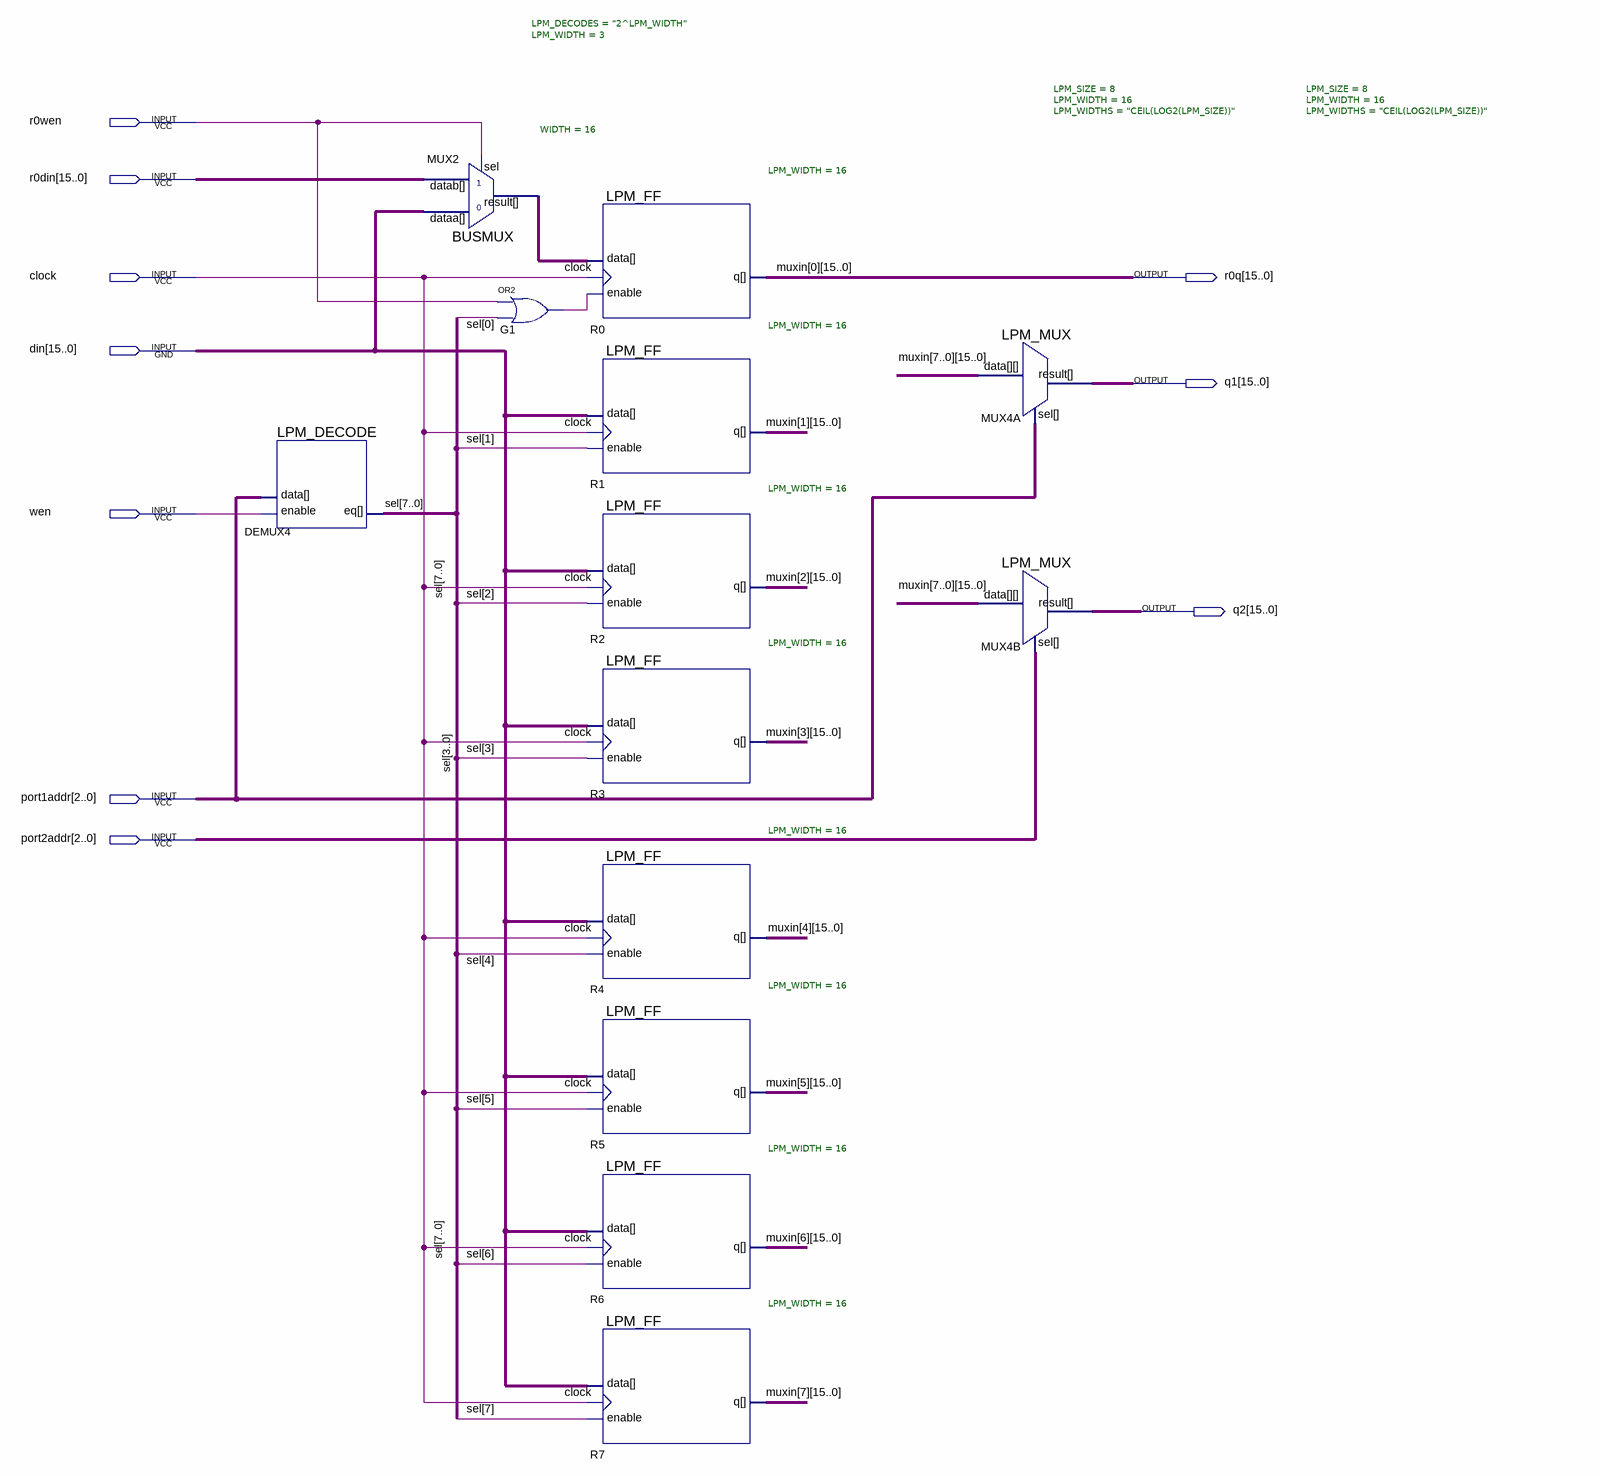
[diagram p0: schematic sheet]
// Quartus schematic regfile8.bdf as structural Verilog: 13 symbols, 10 pins
module regfile8 (
  input  r0wen,
  input  [15:0] r0din,
  input  clock,
  input  [15:0] din,
  input  wen,
  input  [2:0] port1addr,
  input  [2:0] port2addr,
  output [15:0] r0q,
  output [15:0] q1,
  output [15:0] q2
);

  wire G1_out;
  wire [7:0] sel;
  wire [15:0] MUX2_result, muxin_1, muxin_2, muxin_3, muxin_4, muxin_5, muxin_6, muxin_7;

  LPM_DECODE #(.LPM_DECODES("2^LPM_WIDTH"), .LPM_WIDTH(3)) DEMUX4 (.data(port1addr), .enable(wen), .eq(sel));
  BUSMUX #(.WIDTH(16)) MUX2 (.datab(r0din), .sel(r0wen), .dataa(din), .result(MUX2_result));
  or G1 (G1_out, r0wen, sel[0]);
  LPM_FF #(.LPM_WIDTH(16)) R0 (.clock(clock), .data(MUX2_result), .enable(G1_out), .q(r0q));
  LPM_FF #(.LPM_WIDTH(16)) R1 (.clock(clock), .data(din), .enable(sel[1]), .q(muxin_1));
  LPM_FF #(.LPM_WIDTH(16)) R2 (.clock(clock), .data(din), .enable(sel[2]), .q(muxin_2));
  LPM_FF #(.LPM_WIDTH(16)) R3 (.clock(clock), .data(din), .enable(sel[3]), .q(muxin_3));
  LPM_FF #(.LPM_WIDTH(16)) R4 (.clock(clock), .data(din), .enable(sel[4]), .q(muxin_4));
  LPM_FF #(.LPM_WIDTH(16)) R5 (.clock(clock), .data(din), .enable(sel[5]), .q(muxin_5));
  LPM_FF #(.LPM_WIDTH(16)) R6 (.clock(clock), .data(din), .enable(sel[6]), .q(muxin_6));
  LPM_FF #(.LPM_WIDTH(16)) R7 (.clock(clock), .data(din), .enable(sel[7]), .q(muxin_7));
  LPM_MUX #(.LPM_SIZE(8), .LPM_WIDTH(16), .LPM_WIDTHS("CEIL(LOG2(LPM_SIZE))")) MUX4A (
    .data({muxin_7, muxin_6, muxin_5, muxin_4, muxin_3, muxin_2, muxin_1, r0q}), .sel(port1addr), .result(q1));
  LPM_MUX #(.LPM_SIZE(8), .LPM_WIDTH(16), .LPM_WIDTHS("CEIL(LOG2(LPM_SIZE))")) MUX4B (
    .data({muxin_7, muxin_6, muxin_5, muxin_4, muxin_3, muxin_2, muxin_1, r0q}), .sel(port2addr), .result(q2));

  // Other names for the same wires on the sheet: muxin_0[15:0] = r0q
endmodule
